# Altium schematic sheet led_column.SchDoc
size A
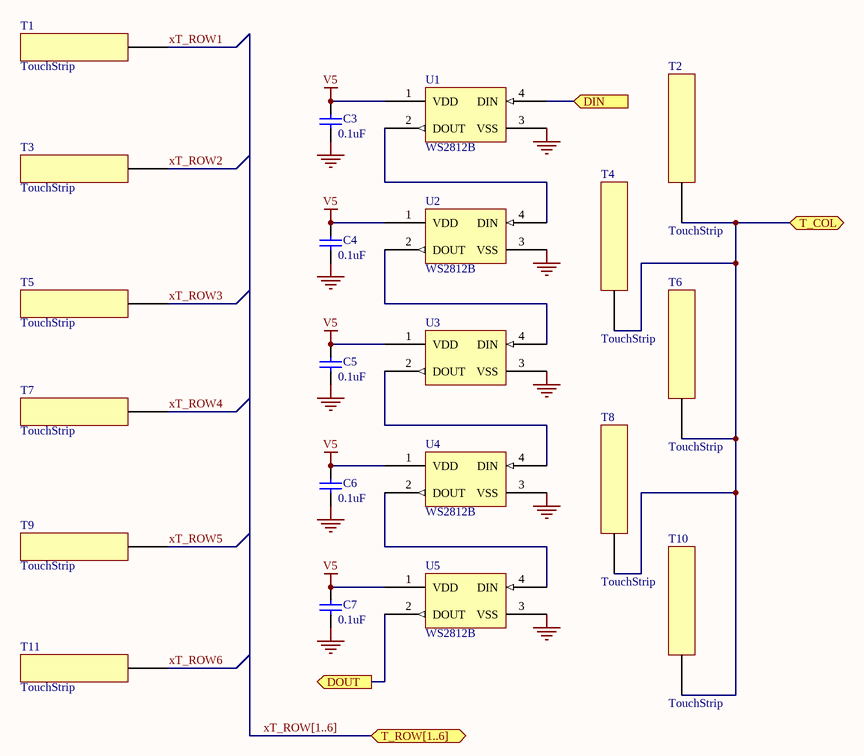
[diagram p0: led_column.SchDoc]

## Parts
C3  0.1uF  [CAPC2012L]
C4  0.1uF  [CAPC2012L]
C5  0.1uF  [CAPC2012L]
C6  0.1uF  [CAPC2012L]
C7  0.1uF  [CAPC2012L]
T1  TouchStrip  [TouchStrip]
T2  TouchStrip  [TouchStrip]
T3  TouchStrip  [TouchStrip]
T4  TouchStrip  [TouchStrip]
T5  TouchStrip  [TouchStrip]
T6  TouchStrip  [TouchStrip]
T7  TouchStrip  [TouchStrip]
T8  TouchStrip  [TouchStrip]
T9  TouchStrip  [TouchStrip]
T10  TouchStrip  [TouchStrip]
T11  TouchStrip  [TouchStrip]
U1  WS2812B  [WS2812B]
U2  WS2812B  [WS2812B]
U3  (no value)  [WS2812B]
U4  WS2812B  [WS2812B]
U5  WS2812B  [WS2812B]

## Ports
DIN (in), DOUT (out), T_COL (bidir), T_ROW[1..6] (bidir)

## Nets
GND: C3.2 C4.2 C5.2 C6.2 C7.2 U1.3(VSS) U2.3(VSS) U3.3(VSS) U4.3(VSS) U5.3(VSS)
V5: C3.1 C4.1 C5.1 C6.1 C7.1 U1.1(VDD) U2.1(VDD) U3.1(VDD) U4.1(VDD) U5.1(VDD)
DIN: U1.4(DIN) ; port DIN
DOUT: U5.2(DOUT) ; port DOUT
T_COL: T2.0 T4.0 T6.0 T8.0 T10.0 ; port T_COL
xT_ROW1: T1.0
xT_ROW2: T3.0
xT_ROW3: T5.0
xT_ROW4: T7.0
xT_ROW5: T9.0
xT_ROW6: T11.0
NetU1_2: U1.2(DOUT) U2.4(DIN)
NetU2_2: U2.2(DOUT) U3.4(DIN)
NetU3_2: U3.2(DOUT) U4.4(DIN)
NetU4_2: U4.2(DOUT) U5.4(DIN)

## Buses and harness runs
bus xT_ROW[1..6] = port T_ROW[1..6]

## Library data of the parts
C3-C7 = Cap: Capacitor; Published: 8-Jun-2000; LatestRevisionDate: 17-Jul-2002; LatestRevisionNote: Re-released for DXP Platform.; PackageReference: RAD-0.3; Publisher: Altium Limited; PackageDescription: Radial Cap, Thru-Hole; 2 Leads; 0.3 in Pin Spacing; Value: 0.1uF
U3 = WS2812B